# EasyEDA schematic SCH_BLEMouse Keyboard Arm Circuit_2021-11-03.json

## Sheets
1 ESP32_Sheet: TITLE: Sheet_1; REV: 1.0; Date: 2021-11-02; Sheet: 1/1; Drawn By: morsjosh; Company: Your Company
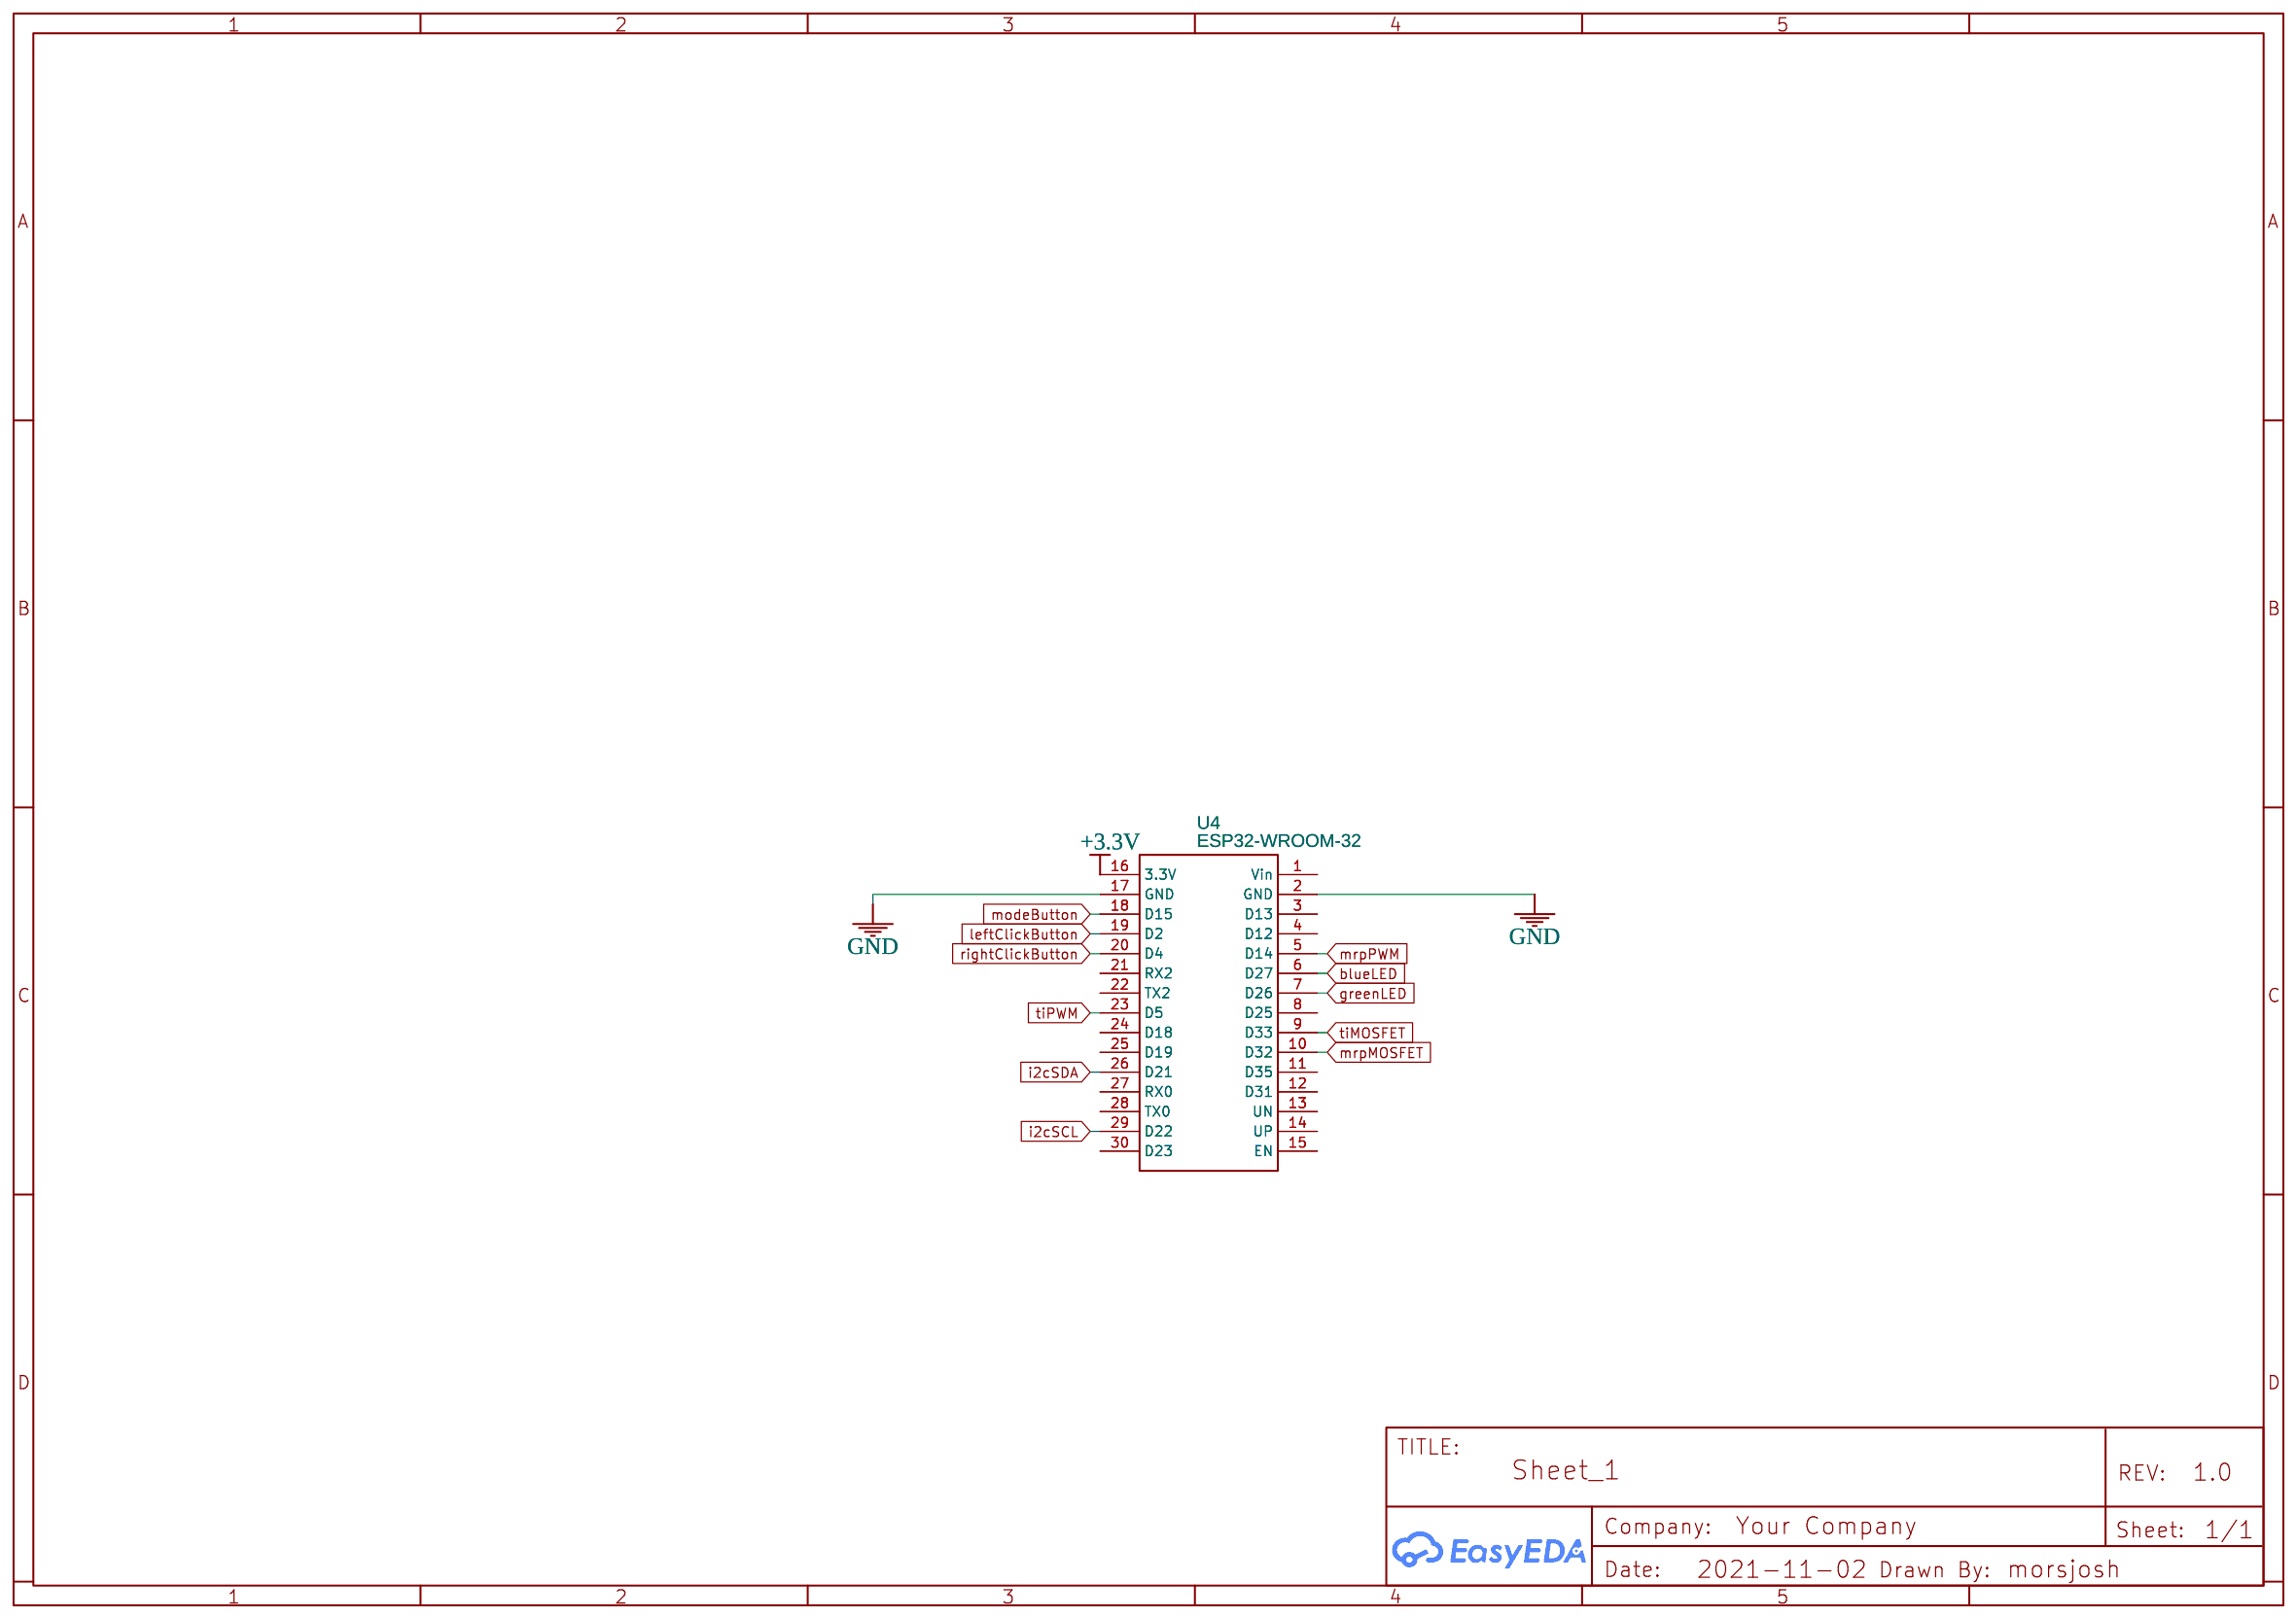
[diagram p0: ESP32_Sheet]
2 Arm_Sheet: TITLE: Sheet_2
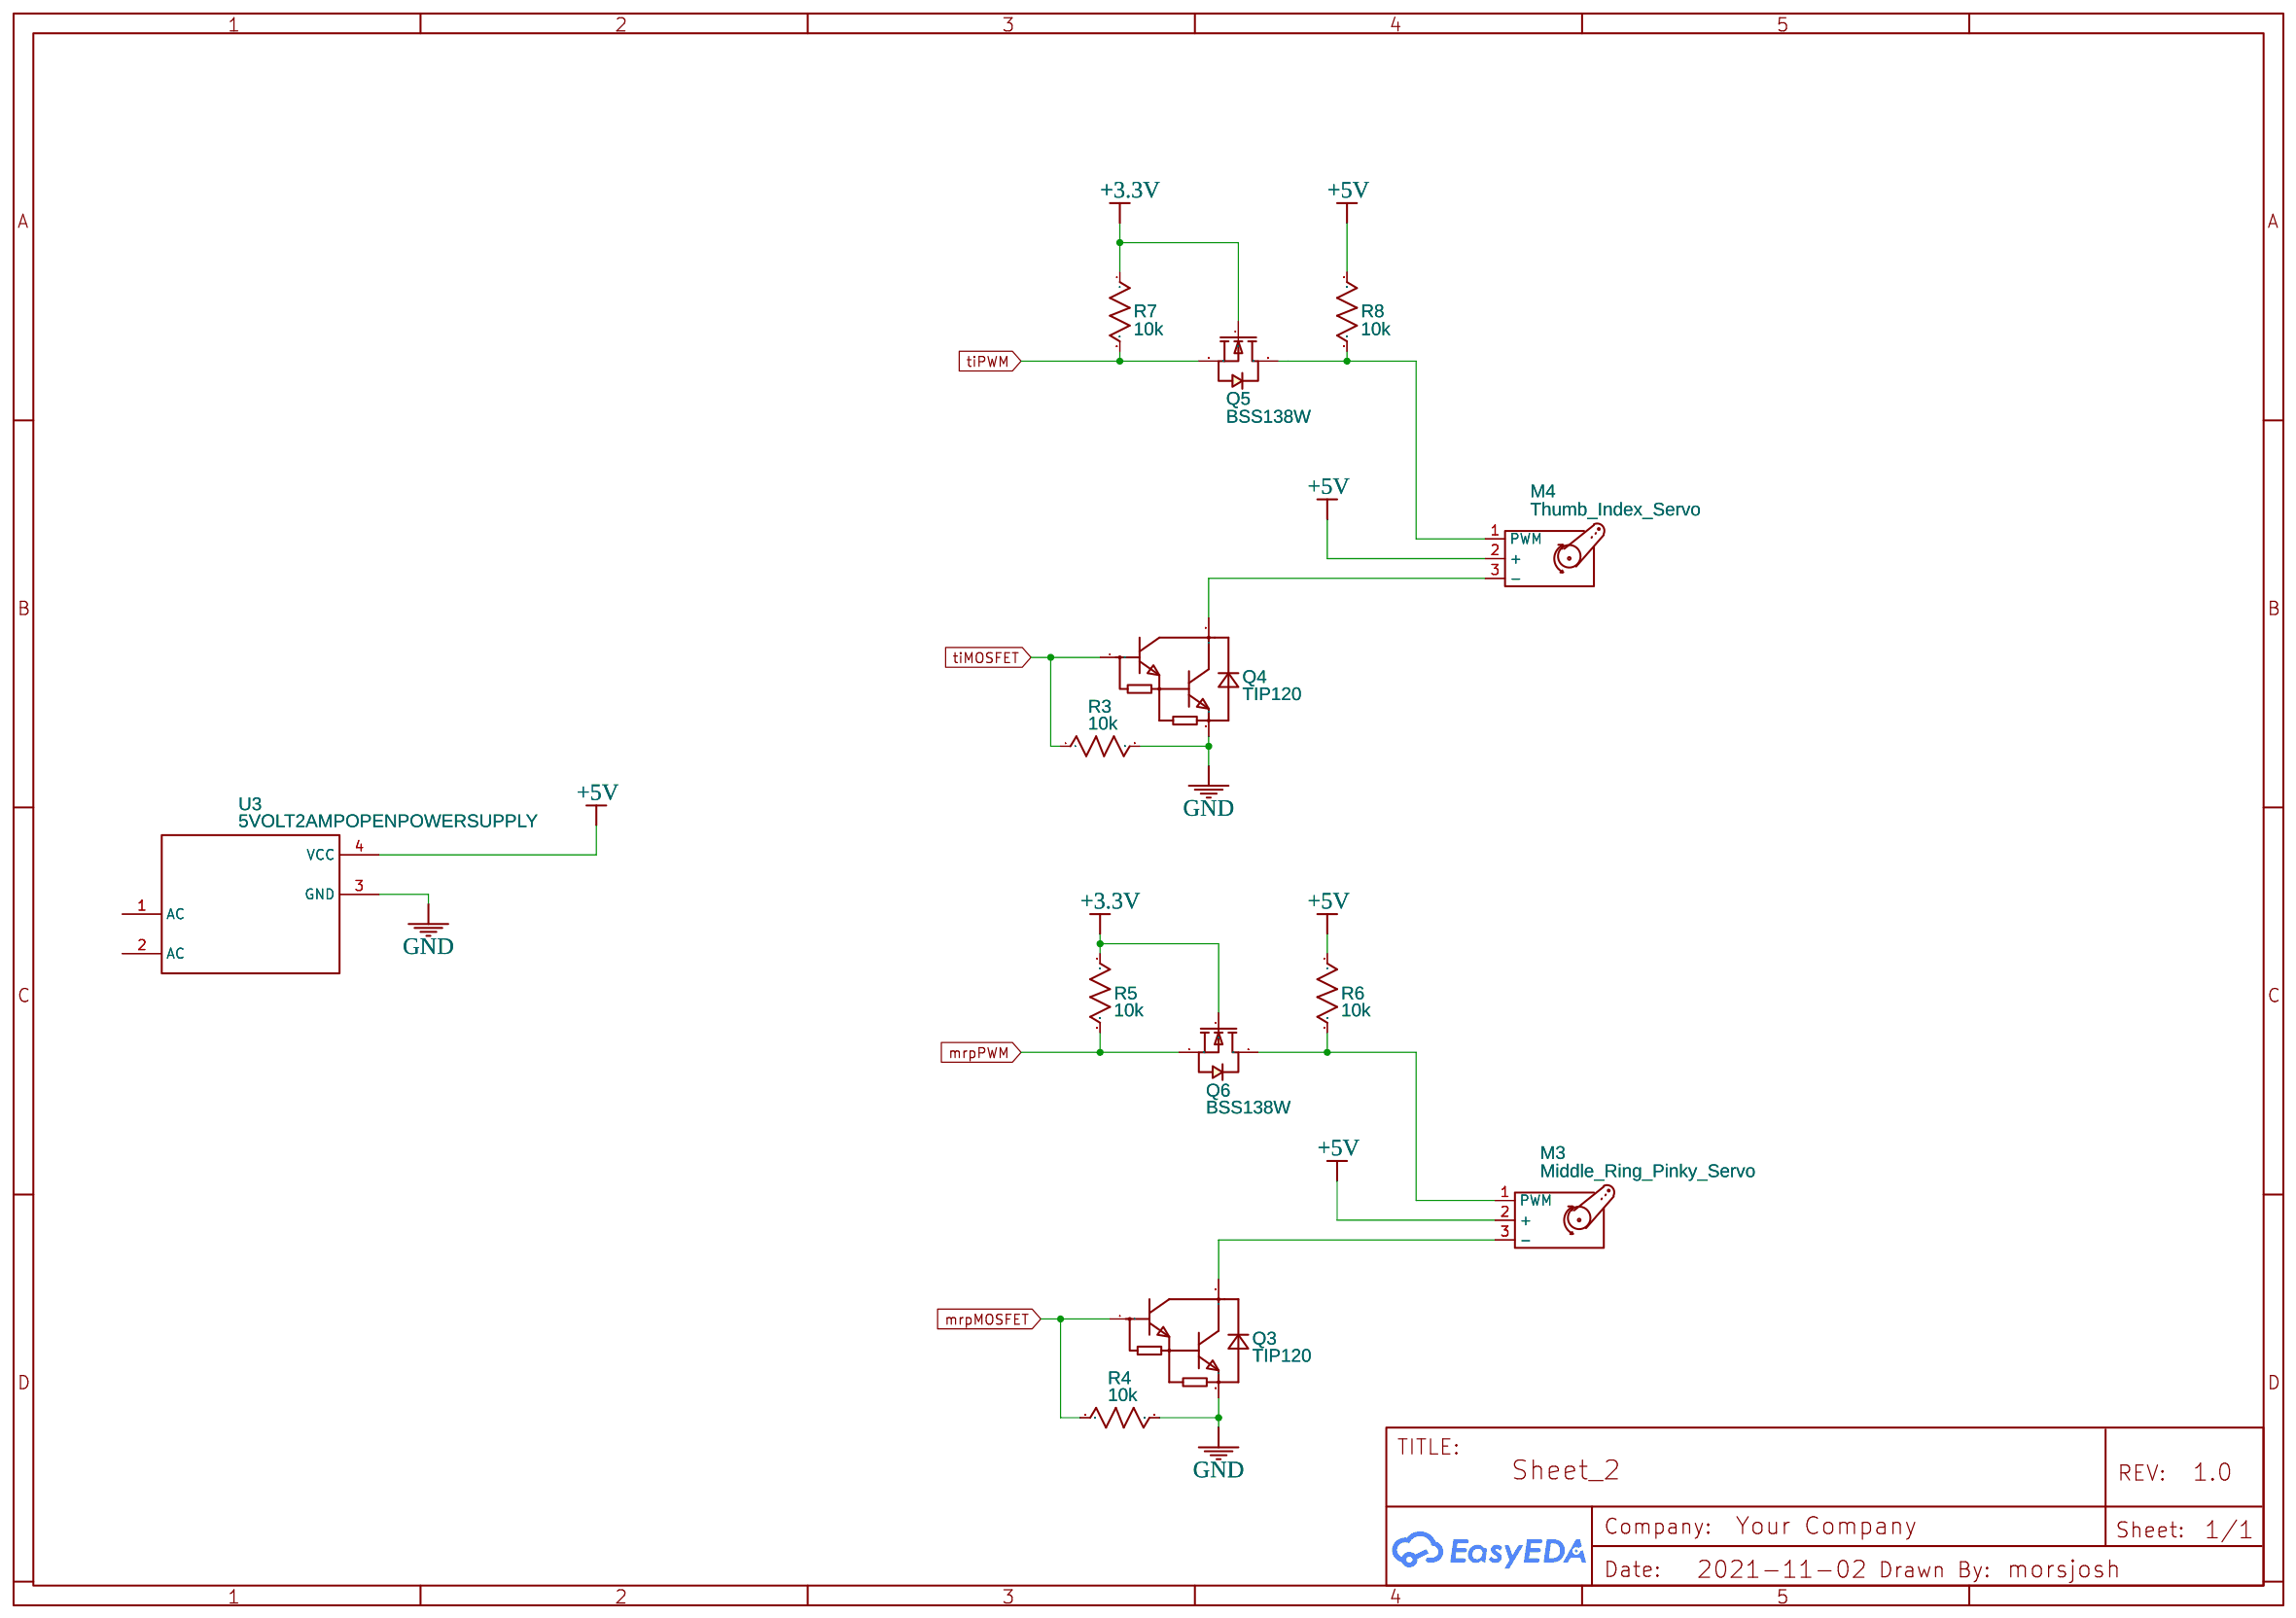
[diagram p1: Arm_Sheet]
3 BLE_Mouse/Keyboard_Sheet: TITLE: Sheet_3
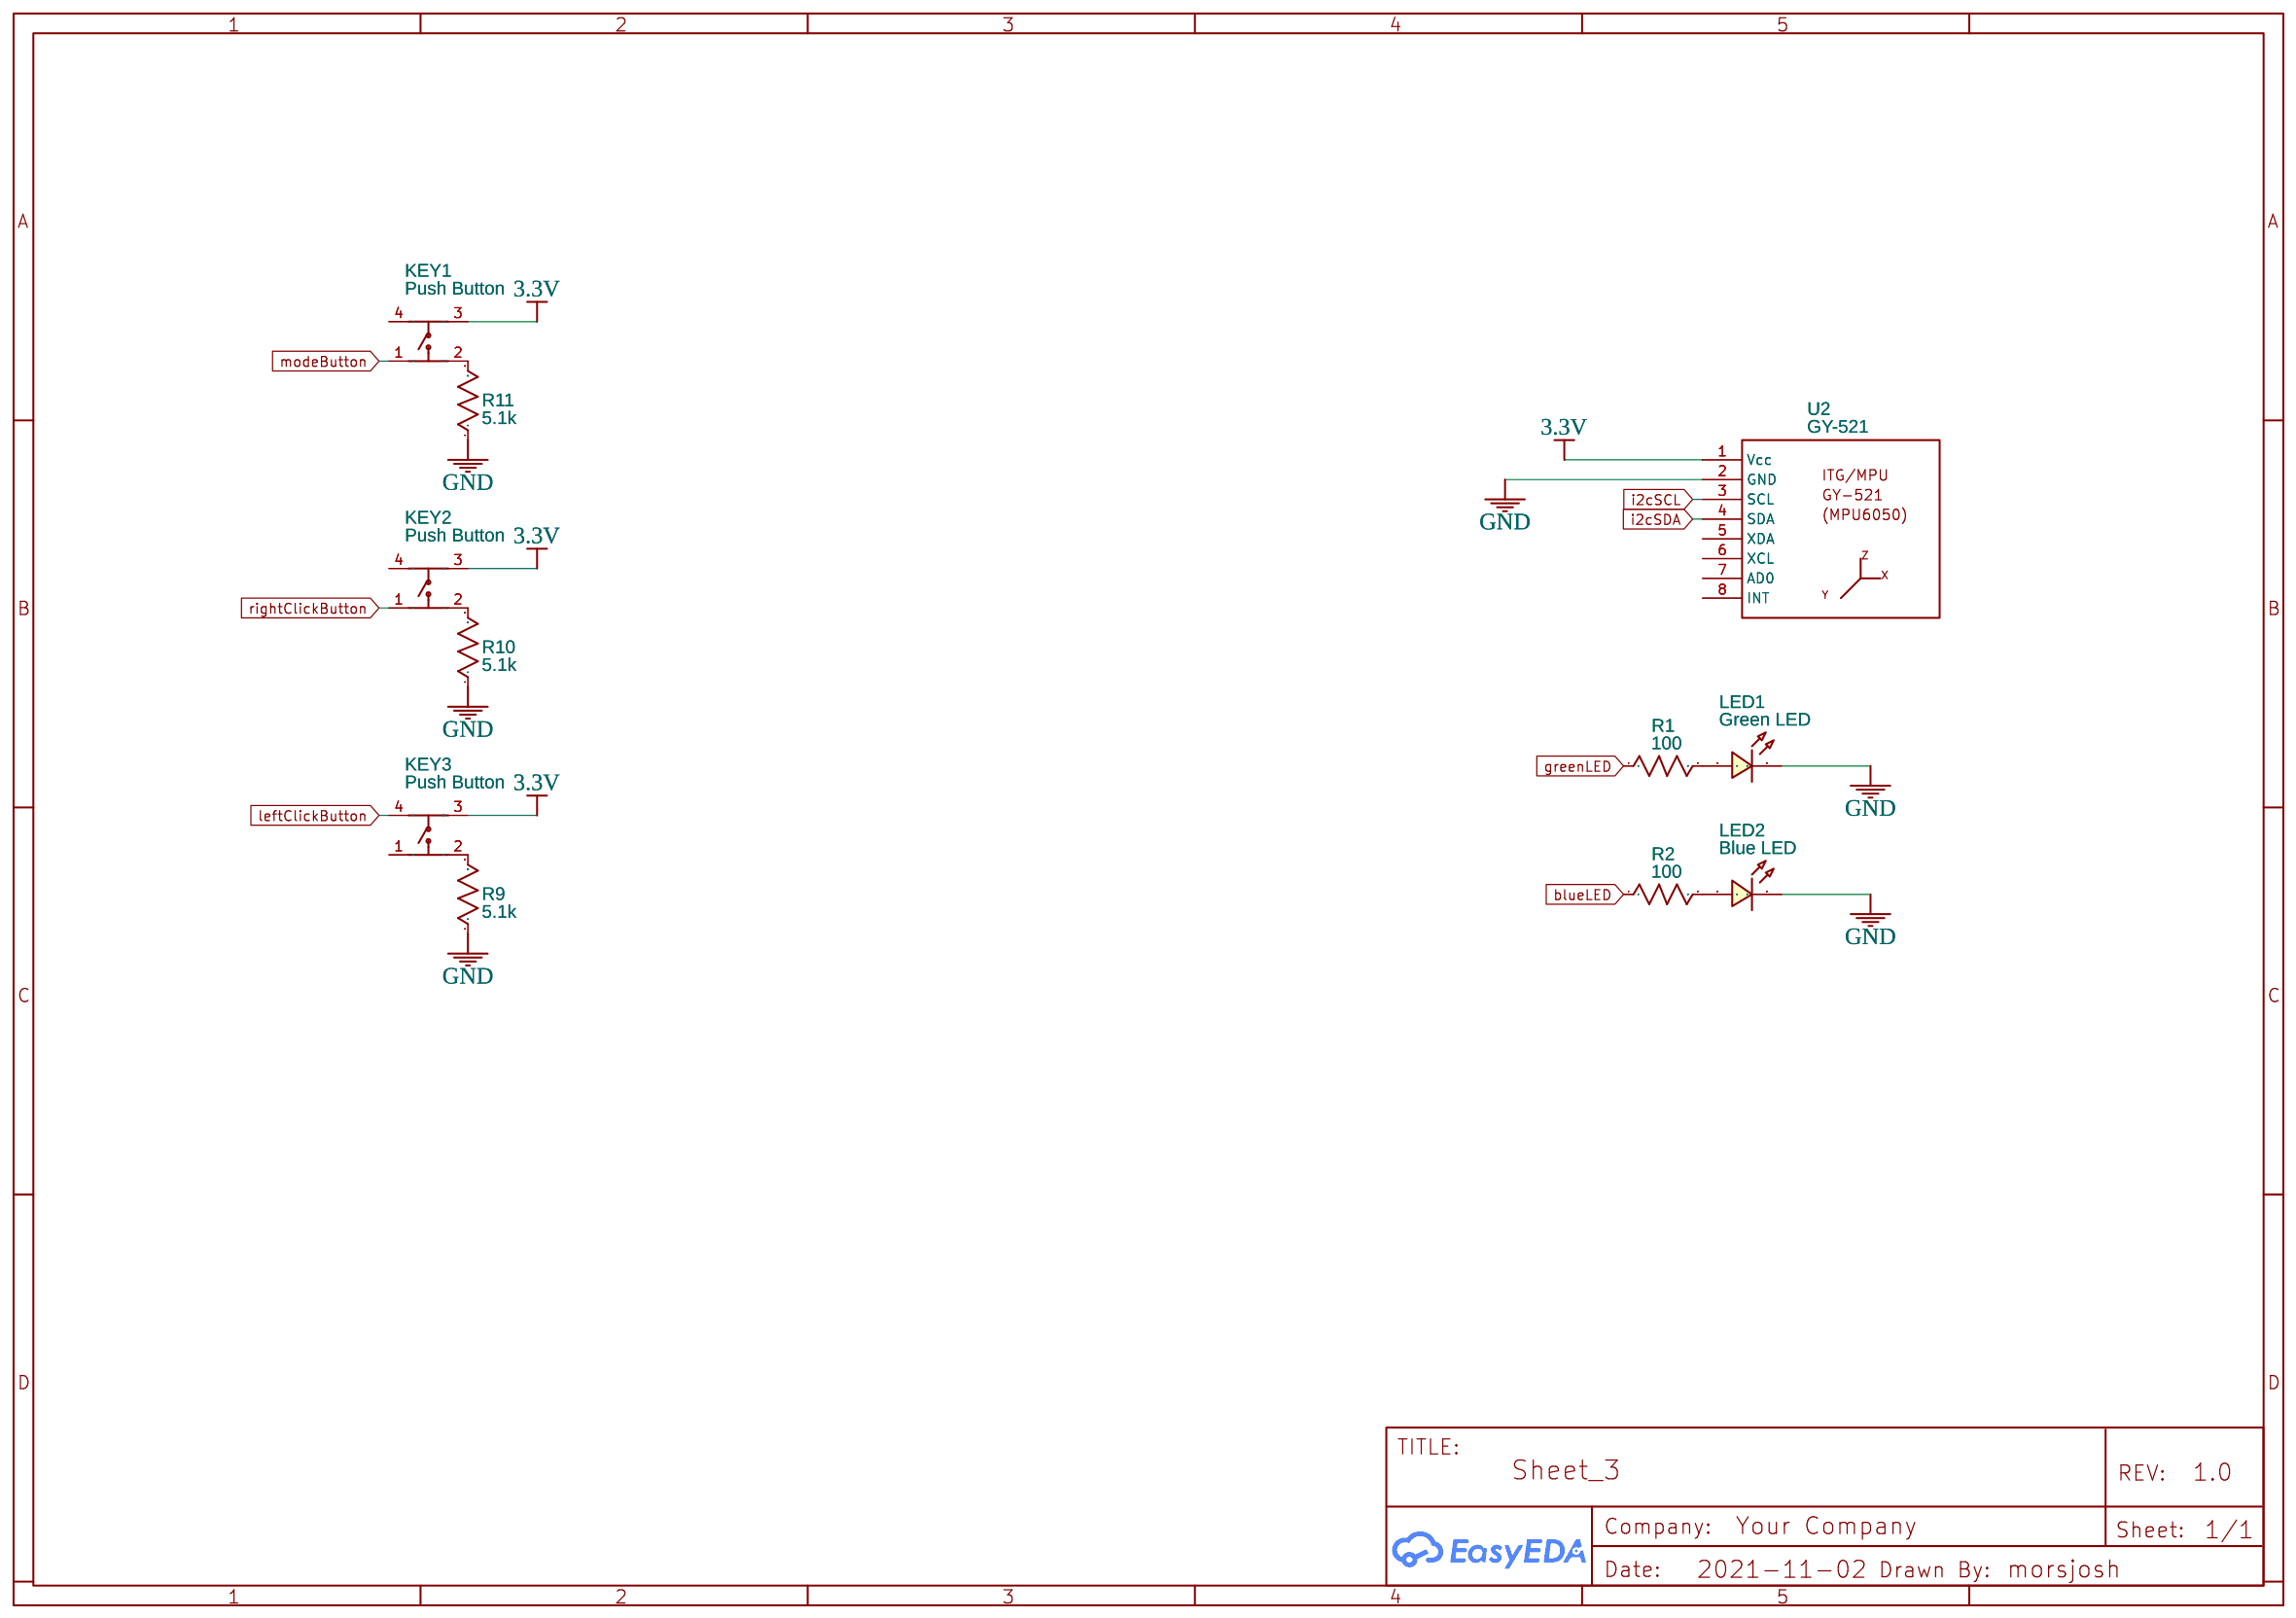
[diagram p2: BLE_Mouse/Keyboard_Sheet]

## Parts
sheet Arm_Sheet
M3  Middle_Ring_Pinky_Servo
M4  Thumb_Index_Servo
Q3  TIP120  [TO-220-3_L10.0-W4.5-P2.54-L]
Q4  TIP120  [TO-220-3_L10.0-W4.5-P2.54-L]
Q5  BSS138W  [SOT-323-3_L2.0-W1.3-P1.30-LS2.1-BR]
Q6  BSS138W  [SOT-323-3_L2.0-W1.3-P1.30-LS2.1-BR]
R3  10k  [R0603]
R4  10k  [R0603]
R5  10k  [R0603]
R6  10k  [R0603]
R7  10k  [R0603]
R8  10k  [R0603]
U3  5VOLT2AMPOPENPOWERSUPPLY  [5VOLT2AMOOPENPOWERSUPPLY]
sheet BLE_Mouse/Keyboard_Sheet
KEY1  Push Button  [KEY-TH_4P-L6.0-W6.0-P4.50-LS7.5]
KEY2  Push Button  [KEY-TH_4P-L6.0-W6.0-P4.50-LS7.5]
KEY3  Push Button  [KEY-TH_4P-L6.0-W6.0-P4.50-LS7.5]
LED1  Green LED  [LED0603_RED]
LED2  Blue LED  [LED0603_RED]
R1  100  [R0201]
R2  100  [R0201]
R9  5.1k  [R0201]
R10  5.1k  [R0201]
R11  5.1k  [R0201]
U2  GY-521  [GY-521]
sheet ESP32_Sheet
U4  ESP32-WROOM-32  [ESP32-WROOM-32]

## Library data of the parts
M3 M4 = Motor_Servo: Contributor: KiCAD; license: https://www.gnu.org/licenses/lgpl-2.1.html
Q3 Q4 = TIP120: Supplier: LCSC; Supplier Part: C262990; Manufacturer: STMicroelectronics; Contributor: LCSC; JLCPCB Part Class: Extended Part
Q5 Q6 = BSS138W: Supplier: LCSC; Supplier Part: C504052; Manufacturer: CJ; Contributor: LCSC; JLCPCB Part Class: Extended Part
R3-R8 = R_0603_US: Contributor: LCEDA_Lib
U3 = 5VOLT2AMPOPENPOWERSUPPLY: Contributor: himanshusingh0046
KEY1-KEY3 = button6*6*8: Supplier Part: C59982; Supplier: LCSC; Manufacturer: ReliaPro
LED1 LED2 = LED-0603_R: Manufacturer: EVERLIGHT(台湾亿光); Manufacturer Part: 19-217/R6C-AL1M2VY/3T; Supplier Part: C72044; Supplier: LCSC; Contributor: LCEDA_01
R1 R2 R9-R11 = R_0201_US: Contributor: LCEDA_Lib
U2 = GY-521: Contributor: Юрий Владимирович (Duck Duck)
U4 = ESP32-WROOM-32: Manufacturer: Espressif; Supplier: Espressif; link: https://www.espressif.com/sites/default/files/documentation/esp32_datasheet_en.pdf; Contributor: neil060802

## Nets
3.3V: KEY1.3 KEY2.3 KEY3.3 U2.1(Vcc)
+3.3V: Q5.1(G) Q6.1(G) R5.1 R7.1 U4.16(3.3V)
+5V: M3.2(+) M4.2(+) R6.1 R8.1 U3.4(VCC)
GND: LED1.2 LED2.2 Q3.3(E) Q4.3(E) R3.2 R4.2 R9.1 R10.1 R11.1 U2.2(GND) U3.3(GND) U4.2(GND) U4.17(GND)
blueLED: R2.1 U4.6(D27)
greenLED: R1.1 U4.7(D26)
i2cSCL: U2.3(SCL) U4.29(D22)
i2cSDA: U2.4(SDA) U4.26(D21)
leftClickButton: KEY3.4 U4.19(D2)
modeButton: KEY1.1 U4.18(D15)
mrpMOSFET: Q3.1(B) R4.1 U4.10(D32)
mrpPWM: Q6.2(S) R5.2 U4.5(D14)
rightClickButton: KEY2.1 U4.20(D4)
tiMOSFET: Q4.1(B) R3.1 U4.9(D33)
tiPWM: Q5.2(S) R7.2 U4.23(D5)
Net-(KEY1-2): KEY1.2 R11.2
Net-(KEY2-2): KEY2.2 R10.2
Net-(KEY3-2): KEY3.2 R9.2
Net-(LED1-1): LED1.1 R1.2
Net-(LED2-1): LED2.1 R2.2
Net-(M3-1): M3.1(PWM) Q6.3(D) R6.2
Net-(M3-3): M3.3(-) Q3.2(C)
Net-(M4-1): M4.1(PWM) Q5.3(D) R8.2
Net-(M4-3): M4.3(-) Q4.2(C)

Not connected (* = marked no-connect by the designer): KEY1 4; KEY2 4; KEY3 1; U2 5(XDA) 6(XCL) 7(AD0) 8(INT); U3 1(AC) 2(AC); U4 1(Vin) 3(D13) 4(D12) 8(D25) 11(D35) 12(D31) 13(UN) 14(UP) 15(EN) 21(RX2) 22(TX2) 24(D18) 25(D19) 27(RX0) 28(TX0) 30(D23)
